# Altium schematic sheet CON-USB.SchDoc: USB Host
size A; DocumentNumber: 11; SheetNumber: 11; SheetTotal: 11
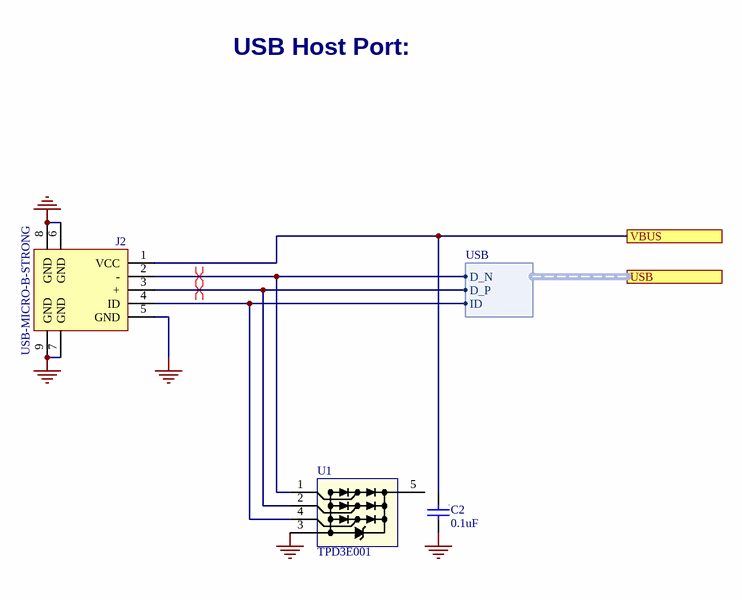
[diagram p0: CON-USB.SchDoc]

## Parts
C2  value 0.1uF  [0402]  (hidden comment: Cap)
J2  USB-MICRO-B-STRONG  [USB Micro AB R/A THR - design]
U1  TPD3E001  [SOTFL50P160X60-5N]

## Ports
USB (harness USB), VBUS

## Harnesses
USB: D_N, D_P, ID

## Nets
GND: C2.2 J2.5(GND) J2.6(GND) J2.7(GND) J2.8(GND) J2.9(GND) U1.3
VBUS: C2.1 J2.1(VCC) ; port VBUS
NetJ2_2: J2.2(-) U1.1 ; port USB.D_N
NetJ2_3: J2.3(+) U1.2 ; port USB.D_P
NetJ2_4: J2.4(ID) U1.4(nc) ; port USB.ID

Not connected (* = marked no-connect by the designer): U1 5(nc)

## Layout directives
differential pair; differential pair class USB: NetJ2_2, NetJ2_3

## Notes on the sheet
- USB Host Port:
- Date
- Sheet
- Project
- Time
- PCB
- Assy
- of
- Size
- A
- File

## Library data of the parts
C2 = Cap: CAP CER .10UF 50V X7R 10% 0402; Manufacturer: TDK Corporation; Manufacturer Part Number: C1005X7R1H104K; Capacitance: 0.1µF; Published: 8-Jun-2000; LatestRevisionDate: 17-Jul-2002; LatestRevisionNote: Re-released for DXP Platform.; Publisher: Altium Limited; Category: Capacitors; Supplier 1: Digi-Key; Supplier Part Number 1: 445-5932-1-ND; RoHS: RoHS Compliant; Stock 1: 174080; Pricing 1: 1=0.3, 10=0.2, 100=0.08, 250=0.05752, 500=0.041, 1000=0.03 (USD); Voltage - Rated: 50V; Tolerance: ±10%; Temperature Coefficient: X7R; Mounting Type: Surface Mount, MLCC; Operating Temperature: -55°C ~ 125°C; Applications: General Purpose; Ratings: -; Package / Case: 0402 (1005 Metric); Size / Dimension: 0.039" L x 0.020" W (1.00mm x 0.50mm); Height: -; Thickness: 0.022" (0.55mm); Lead Spacing: -; Features: -; Packaging: Cut Tape (CT); Lead Style: -; ComponentLink1URL: http://www.tdk.co.jp/tefe02/e412_c.pdf; ComponentLink1Description: http://www.tdk.co.jp/tefe02/e412_c.pdf
J2 = USB-TYPEAB-4GND: CONN USB MICRO B RECPT SMT R/A; Manufacturer: Amphenol FCI; Manufacturer Part Number: 10118194-0001LF; Gender: Receptacle; Current Rating: 1.8A; Connector Type: USB,Receptacle; Number of Contacts: 5; Insulation Resistance: 1GR; Number of Ports: 1; Max Voltage Rating (AC): 100V; Pitch: 0.65mm; ComponentLink1URL: https://datasheet.ciiva.com/851/10118194-851110.pdf; ComponentLink1Description: https://datasheet.ciiva.com/851/10118194-851110.pdf; ComponentLink2URL: https://datasheet.ciiva.com/851/10118194-851111.pdf; ComponentLink2Description: https://datasheet.ciiva.com/851/10118194-851111.pdf; ComponentLink3URL: https://datasheet.ciiva.com/4598/10118194ac-197217-4598807.pdf; ComponentLink3Description: https://datasheet.ciiva.com/4598/10118194ac-197217-4598807.pdf; ComponentLink4URL: https://datasheet.ciiva.com/29907/10118194-29907230.pdf; ComponentLink4Description: https://datasheet.ciiva.com/29907/10118194-29907230.pdf; ComponentLink5URL: https://datasheet.ciiva.com/26945/getdatasheetpartid-418619-26945695.pdf; ComponentLink5Description: https://datasheet.ciiva.com/26945/getdatasheetpartid-418619-26945695.pdf; Supplier 1: Digi-Key; Supplier Part Number 1: 609-4618-6-ND; Stock 1: 178809; Pricing 1: 1=0.5, 10=0.464, 25=0.418, 50=0.3716, 100=0.3561, 250=0.32516, 500=0.30966 (USD); Mount: Surface Mount,Horizontal; Colour: Black; Contact Material: Copper Alloy; Contact Plating: Gold; Number of Terminals: 5; Housing Material: Polymer; Min Operating Temperature: -55°C; Max Operating Temperature: 85°C; Package Quantity: 9600; Packaging: Tape and Reel; Termination: Solder; Orientation: Right Angle; Features: Shielded; Length: 8.05mm; Depth: 5mm; Radiation Hardening: No; Lead Free: Lead Free; Flammability Rating: UL94 V-0
U1 = TPD3E001: TVS DIODE 5.5V SOT5; Manufacturer: Texas Instruments; Manufacturer Part Number: TPD3E001DRLR; Direction: Unidirectional; Number of Channels: 3; Min Supply Voltage: 900mV; Capacitance: 1.5pF; Min Breakdown Voltage: 11V; Peak Pulse Power: 90W; Power Line Protection: Yes; Clamping Voltage: 105.5V; Leakage Current: 1nA; Max Supply Current: 100nA; Interface: USB; Supplier 1: Digi-Key; Supplier Part Number 1: 296-21885-1-ND; Stock 1: 81393; Pricing 1: 1=0.53, 10=0.454, 100=0.3392, 500=0.26648, 1000=0.20592 (USD); Case/Package: SOT; Number of Pins: 5; Weight: 9.9E-05oz; Min Operating Temperature: -40°C; Max Operating Temperature: 85°C; Max Supply Voltage: 5.5V; Packaging: Tape and Reel; Max Supply Voltage (DC): 5.5V; Min Supply Voltage (DC): 900mV; Package Quantity: 1; Number of Bidirectional Channels: 3; Reverse Standoff Voltage: 5.5V; Breakdown Voltage: 11V; Termination: SMD/SMT; Nominal Supply Current: 1nA; Length: 1.6mm; Height: 0.55mm; Width: 1.2mm; Depth: 1.2mm; Radiation Hardening: No; REACH SVHC: No SVHC; Lead Free: Lead Free